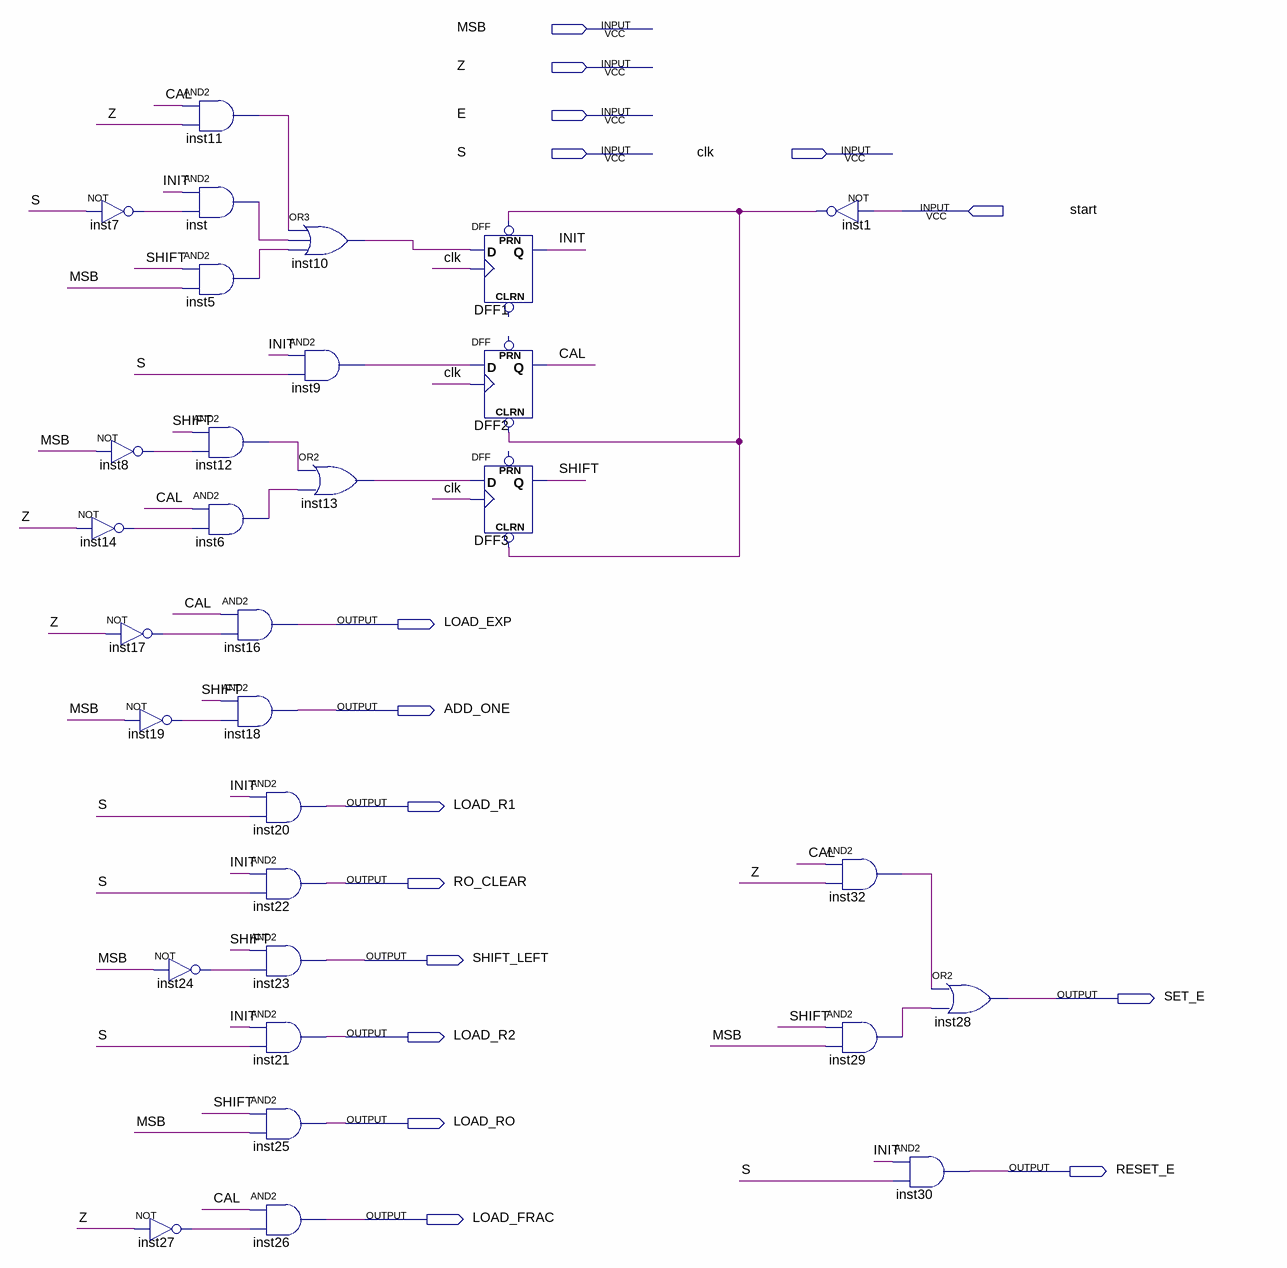
[diagram p0: schematic sheet]
// Quartus schematic CONTROL_UNIT.bdf as structural Verilog: 31 symbols, 16 pins
module CONTROL_UNIT (
  input  MSB,
  input  Z,
  input  E,
  input  S,
  input  clk,
  input  start,
  output LOAD_EXP,
  output ADD_ONE,
  output LOAD_R1,
  output RO_CLEAR,
  output SHIFT_LEFT,
  output SET_E,
  output LOAD_R2,
  output LOAD_RO,
  output RESET_E,
  output LOAD_FRAC
);

  wire CAL, INIT, inst1_out, inst5_out, inst6_out, inst7_out, inst8_out, inst9_out, inst10_out, inst11_out,
       inst12_out, inst13_out, inst14_out, inst17_out, inst19_out, inst24_out, inst27_out, inst29_out,
       inst32_out, inst_out, SHIFT;

  not inst7 (inst7_out, S);
  not inst8 (inst8_out, MSB);
  not inst14 (inst14_out, Z);
  not inst17 (inst17_out, Z);
  not inst19 (inst19_out, MSB);
  not inst27 (inst27_out, Z);
  and inst11 (inst11_out, CAL, Z);
  and inst (inst_out, INIT, inst7_out);
  and inst5 (inst5_out, SHIFT, MSB);
  and inst12 (inst12_out, SHIFT, inst8_out);
  and inst6 (inst6_out, CAL, inst14_out);
  and inst16 (LOAD_EXP, CAL, inst17_out);
  and inst18 (ADD_ONE, SHIFT, inst19_out);
  not inst24 (inst24_out, MSB);
  or inst10 (inst10_out, inst11_out, inst_out, inst5_out);
  and inst9 (inst9_out, INIT, S);
  or inst13 (inst13_out, inst12_out, inst6_out);
  and inst20 (LOAD_R1, INIT, S);
  and inst22 (RO_CLEAR, INIT, S);
  and inst23 (SHIFT_LEFT, SHIFT, inst24_out);
  and inst21 (LOAD_R2, INIT, S);
  and inst25 (LOAD_RO, SHIFT, MSB);
  and inst26 (LOAD_FRAC, CAL, inst27_out);
  DFF DFF1 (.CLK(clk), .D(inst10_out), .PRN(inst1_out), .Q(INIT));  // open: CLRN
  DFF DFF2 (.CLRN(inst1_out), .CLK(clk), .D(inst9_out), .Q(CAL));  // open: PRN
  DFF DFF3 (.CLRN(inst1_out), .CLK(clk), .D(inst13_out), .Q(SHIFT));  // open: PRN
  not inst1 (inst1_out, start);
  and inst32 (inst32_out, CAL, Z);
  and inst29 (inst29_out, SHIFT, MSB);
  and inst30 (RESET_E, INIT, S);
  or inst28 (SET_E, inst32_out, inst29_out);
endmodule
